# Altium schematic sheet Power Supply.SchDoc
size 594 x 420 mm; SheetNumber: 6; PageSetup: Record=PageOptions|CenterHorizontal=False|CenterVertical=False|PrintScale=1.00|XCorrection=0.00|YCorrection=0.00|PrintKind=1|BorderSize=5000000|LeftOffset=0|BottomOffset=0|Orientation=2|PaperLength=1000|PaperWidth=1000|Scale=100|PaperSource=7|PrintQuality=-4|MediaType=1|DitherType=10|PaperKind=A3 (297 x 420 mm)|PrintScaleMode=0
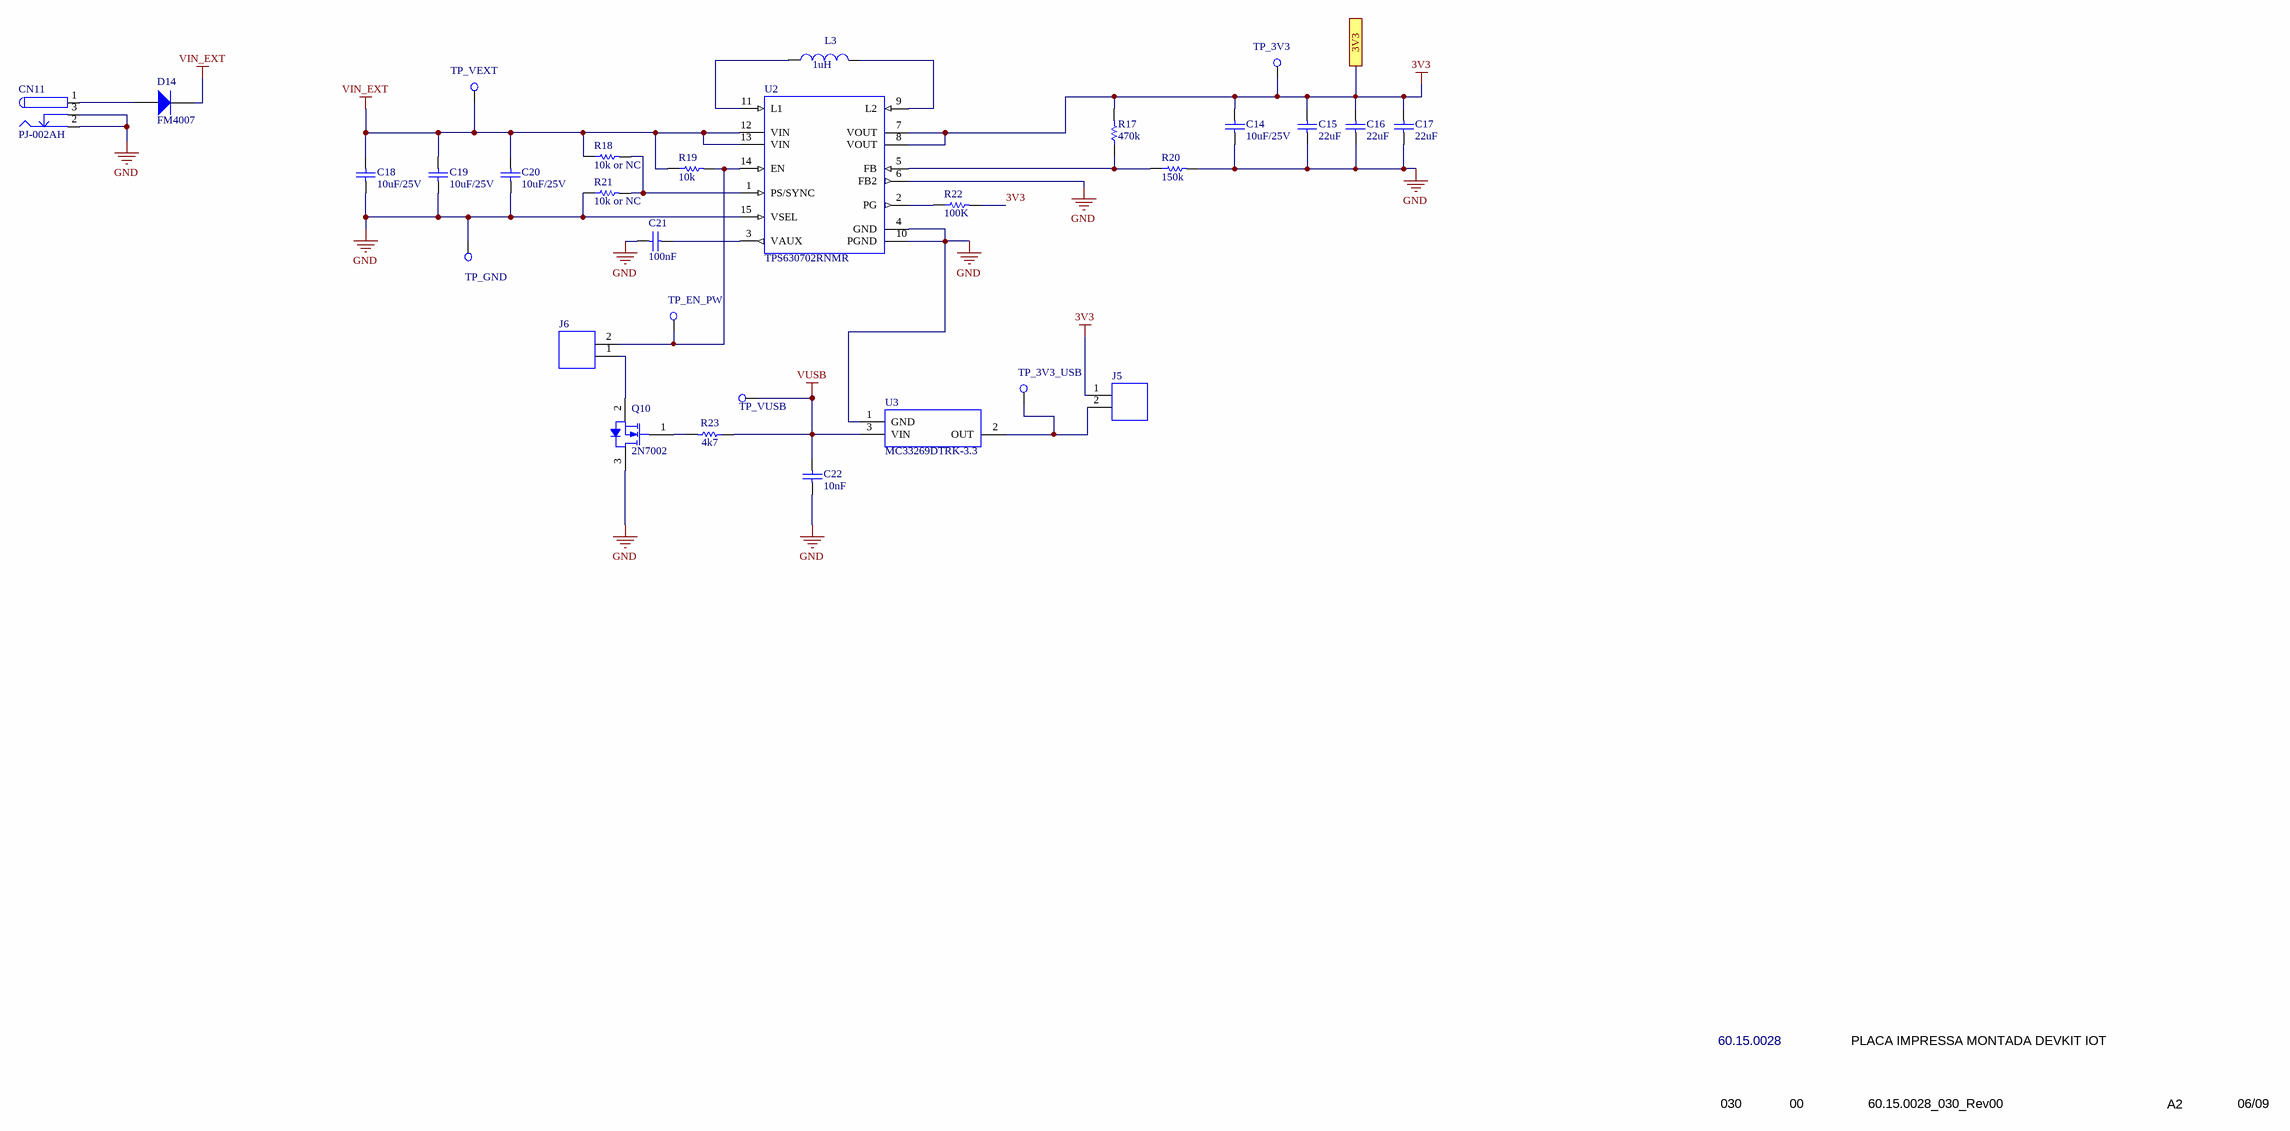
[diagram p0: Power Supply.SchDoc]

## Parts
C14  value 10uF/25V  [16.23.0733]  (hidden comment: 16.23.0733)
C15  16.23.0428  [16.23.0428]  (value not drawn)
C16  16.23.0428  [16.23.0428]  (value not drawn)
C17  16.23.0428  [16.23.0428]  (value not drawn)
C18  value 10uF/25V  [16.23.0735]  (hidden comment: 16.23.0735)
C19  value 10uF/25V  [16.23.0735]  (hidden comment: 16.23.0735)
C20  value 10uF/25V  [16.23.0733]  (hidden comment: 16.23.0733)
C21  value 100nF  [16.23.0807]  (hidden comment: 16.23.0807)
C22  16.23.0427  [16.23.0427]  (value not drawn)
CN11  CUI INC: PJ-002AH  [28.39.0015]  (hidden comment: 28.39.0015)
D14  value FM4007  [32.21.0028]  (hidden comment: 32.21.0028)
J5  70.11.0010  [70.11.0010]  (value not drawn)
J6  70.11.0010  [70.11.0010]  (value not drawn)
L3  value 1uH  [40.12.0346]  (hidden comment: 40.12.0346)
Q10  72.19.0021  [72.19.0021]  (value not drawn)
R17  value 470k  [66.21.1644]  (hidden comment: 66.21.1644)
R18  value 10k or NC  [66.21.1646]  (hidden comment: 66.21.1646)
R19  value 10k  [66.21.1646]  (hidden comment: 66.21.1646)
R20  value 150k  [66.21.1645]  (hidden comment: 66.21.1645)
R21  value 10k or NC  [66.21.1646]  (hidden comment: 66.21.1646)
R22  value 100K  [66.24.1346]  (hidden comment: 66.24.1346)
R23  value 4k7  [66.24.1353]  (hidden comment: 66.24.1353)
TP_3V3  TESTPOINT  [TESTPOINT-60MILS]  (value not drawn)
TP_3V3_USB  TESTPOINT  [TESTPOINT-60MILS]  (value not drawn)
TP_EN_PW  TESTPOINT  [TESTPOINT-60MILS]  (value not drawn)
TP_GND  TESTPOINT  [TESTPOINT-60MILS]  (value not drawn)
TP_VEXT  TESTPOINT  [TESTPOINT-60MILS]  (value not drawn)
TP_VUSB  TESTPOINT  [TESTPOINT-60MILS]  (value not drawn)
U2  value TPS630702RNMR  [26.24.0200]  (hidden comment: 26.24.0200)
U3  value MC33269DTRK-3.3  [26.24.0067]  (hidden comment: 26.24.0067)

## Ports
3V3

## Nets
3V3: C14.2 C15.2 C16.2 C17.2 J5.1 R17.2 R22.2 TP_3V3.1(TP) U2.7(VOUT) U2.8(VOUT) ; port 3V3
GND: C14.1 C15.1 C16.1 C17.1 C18.1 C19.1 C20.1 C21.1 C22.2 CN11.2 CN11.3 Q10.3(D) R20.2 R21.1 TP_GND.1(TP) U2.4(GND) U2.6(FB2) U2.10(PGND) U2.15(VSEL) U3.1(GND)
VIN_EXT: C18.2 C19.2 C20.2 D14.K R18.1 R19.1 TP_VEXT.1(TP) U2.12(VIN) U2.13(VIN)
VUSB: C22.1 R23.1 TP_VUSB.1(TP) U3.3(VIN)
NetC21_2: C21.2 U2.3(VAUX)
NetCN11_1: CN11.1 D14.A
NetJ5_2: J5.2 TP_3V3_USB.1(TP) U3.2(OUT)
NetJ6_1: J6.1 Q10.2(S)
NetJ6_2: J6.2 R19.2 TP_EN_PW.1(TP) U2.14(EN)
NetL3_1: L3.1 U2.11(L1)
NetL3_2: L3.2 U2.9(L2)
NetQ10_1: Q10.1(G) R23.2
NetR17_1: R17.1 R20.1 U2.5(FB)
NetR18_2: R18.2 R21.2 U2.1(PS/SYNC)
NetR22_1: R22.1 U2.2(PG)

## Notes on the sheet
- 60.15.0028
- PLACA IMPRESSA MONTADA DEVKIT IOT
- 030
- 00
- 60.15.0028_030_Rev00
- A2
- 06/09
- 1
- 2
- 3
- 4
- 5
- 6
- 7
- 8
- A
- B
- C
- D
- E
- F
- G
- H
- DOCUMENTO DE ENGENHARIA DE PRODUTO
- DOCUMENT OF PRODUCT ENGINEERING
- CÓDIGO / CODE
- DESCRIÇÃO / DESCRIPTION
- DOC
- REV
- ARQUIVO / FILE
- FORM./SIZE
- FOLHA / PAGE
- (in symbol 16.23.0427) 10nF
- (in symbol 16.23.0428) 22uF
- (in symbol 72.19.0021) 2N7002

## Library data of the parts
C14 C20 = 16.23.0733: CAPACITOR CERAMICO MULTICAMADAS 10uF 25V 20% SMD 0603 X5R; Part Number: GRM188R61E106MA73; Fabricante: Murata
C15-C17 = 16.23.0428: CC MUL 22uF 16V X5R 20% SMD 0805
C18 C19 = 16.23.0735: CAPACITOR CERAMICO MULTICAMADAS 10uF 25V 10% SMD 0805 X5R; Part Number: GRM21BR61E106KA73; Fabricante: Murata
C21 = 16.23.0807: CAPACITOR CERAMICO MULTICAMADAS 100nF 50V X7R 10% SMD 0402
C22 = 16.23.0427: CC MUL 10nF 16V C0G 10%  SMD 0402
CN11 = 28.39.0015: CONECTOR ALIMENTACAO JACK  MODEL PJ-002AH - SMT -TR
D14 = 32.21.0028: DIODO RETIFICADOR 1A 1000V 1N4007 SMD DO-214AC; Parameter 1: RECTRON; Part Number: FM4007
J5 J6 = 70.11.0010: BARRA DE TERMINAIS 1x2
L3 = 40.12.0346: INDUTOR FIXO 1uH 20% 5A 36mOHM SMD 1008
Q10 = 72.19.0021: TRANSISTOR MOSFET N 60V 115MA 0.2W SMD
R17 = 66.21.1644: RESISTOR THICK FILM 470k OHMS 25V 0.05W 1% SMD 0201
R18 R19 R21 = 66.21.1646: RESISTOR THICK FILM 10k OHMS 25V 0.05W 1% SMD 0201
R20 = 66.21.1645: RESISTOR THICK FILM 150k OHMS 25V 0.05W 1% SMD 0201
R22 = 66.24.1346: RESISTOR THICK FILM 50mW 100K OHMS 1% SMD 0201
R23 = 66.24.1353: RESISTOR THICK FILM 4k7 kOHMS 50V 0,1W 1% SMD 0402; Manufactor: PANASONIC; Part Number: ERJ-2RKF4701X
TP_3V3 TP_3V3_USB TP_EN_PW TP_GND TP_VEXT TP_VUSB = TESTPOINT-60MILS: PONTO DE TESTE PARA CAMA DE PREGO
U2 = 26.24.0200: CI REGULADOR TENSAO CHAV AJUST 2A16V 2A DESC SAIDA VQFN-HR
U3 = 26.24.0067: CIL REGULADOR DE TENSAO 3.3V SMD